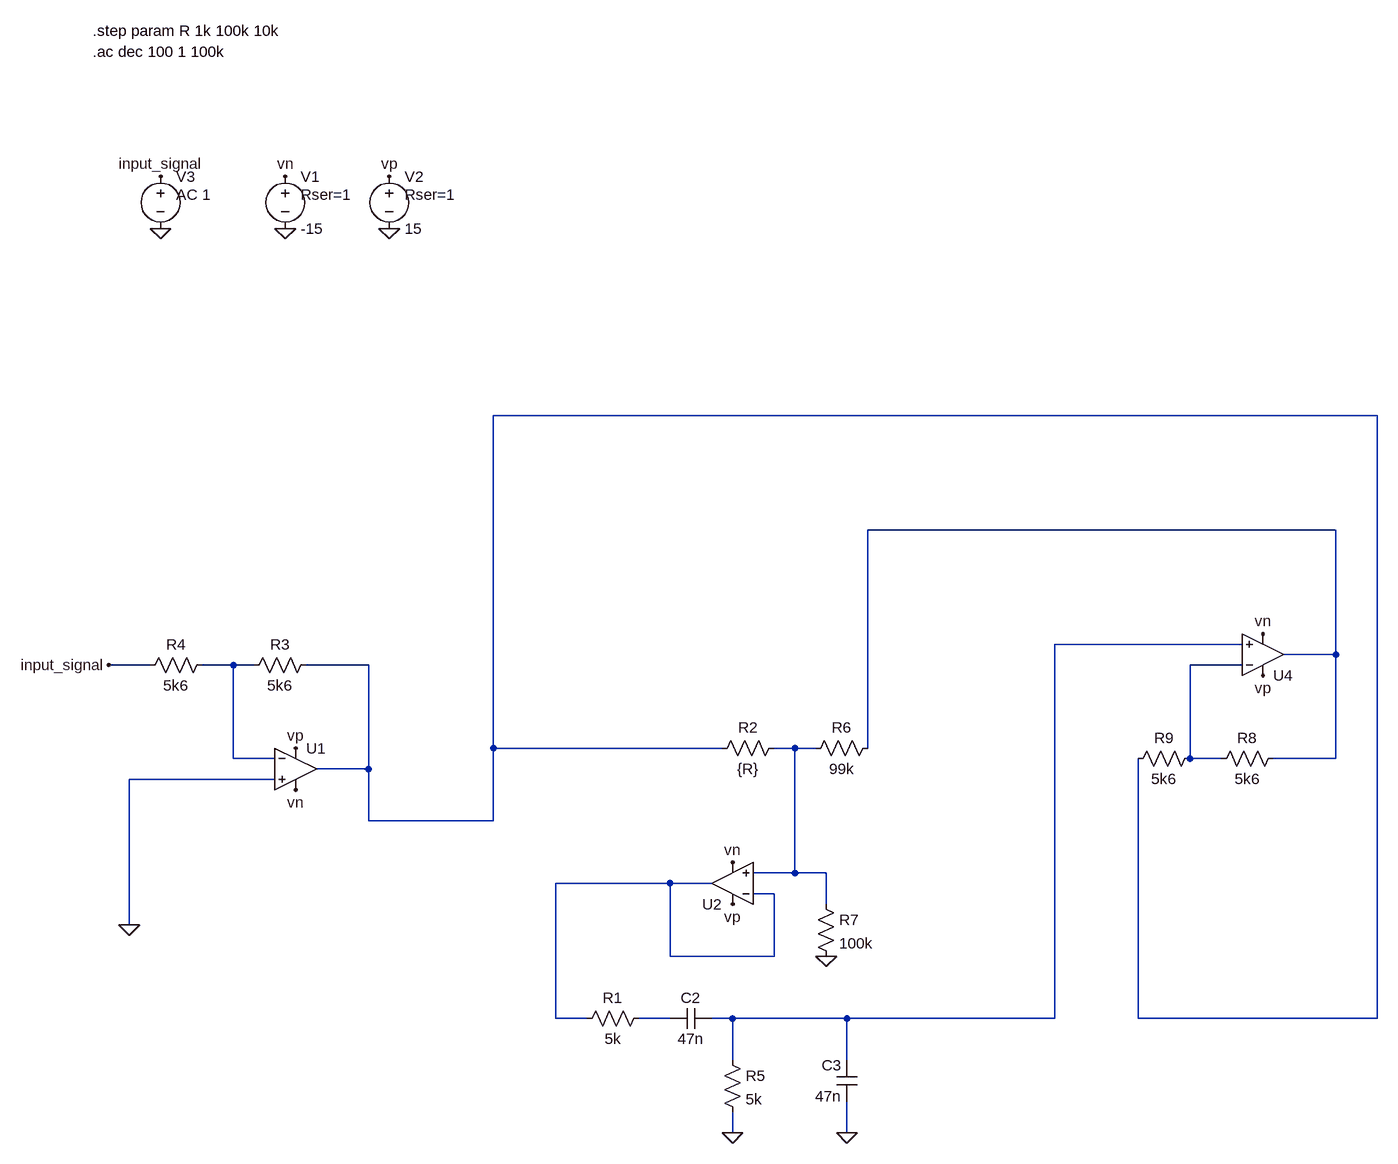
[diagram p0: schematic parametric_eq.asc]
parametric_eq.asc, the LTspice schematic file:
Version 4
SHEET 1 1476 820
WIRE 1360 -736 0 -736
WIRE 1296 -560 576 -560
WIRE 1152 -384 864 -384
WIRE 1296 -368 1296 -560
WIRE 1296 -368 1216 -368
WIRE -528 -352 -592 -352
WIRE -400 -352 -448 -352
WIRE -368 -352 -400 -352
WIRE -192 -352 -288 -352
WIRE 1152 -352 1072 -352
WIRE 0 -224 0 -736
WIRE 352 -224 0 -224
WIRE 464 -224 432 -224
WIRE 496 -224 464 -224
WIRE 576 -224 576 -560
WIRE -400 -208 -400 -352
WIRE -336 -208 -400 -208
WIRE 1072 -208 1072 -352
WIRE 1120 -208 1072 -208
WIRE 1296 -208 1296 -368
WIRE 1296 -208 1200 -208
WIRE -192 -192 -192 -352
WIRE -192 -192 -272 -192
WIRE -336 -176 -560 -176
WIRE -192 -112 -192 -192
WIRE 0 -112 0 -224
WIRE 0 -112 -192 -112
WIRE 464 -32 464 -224
WIRE 464 -32 400 -32
WIRE 512 -32 464 -32
WIRE 272 -16 96 -16
WIRE 336 -16 272 -16
WIRE 432 0 400 0
WIRE 512 16 512 -32
WIRE -560 48 -560 -176
WIRE 272 96 272 -16
WIRE 432 96 432 0
WIRE 432 96 272 96
WIRE 96 192 96 -16
WIRE 144 192 96 192
WIRE 272 192 224 192
WIRE 368 192 336 192
WIRE 544 192 368 192
WIRE 864 192 864 -384
WIRE 864 192 544 192
WIRE 992 192 992 -208
WIRE 1360 192 1360 -736
WIRE 1360 192 992 192
WIRE 368 256 368 192
WIRE 544 256 544 192
WIRE 368 368 368 336
WIRE 544 368 544 320
FLAG 368 368 0
FLAG -304 -224 vp
FLAG -160 -1104 vp
FLAG -304 -160 vn
FLAG -320 -1104 vn
FLAG -320 -1024 0
FLAG -160 -1024 0
FLAG -512 -1104 input_signal
FLAG -512 -1024 0
FLAG 544 368 0
FLAG -592 -352 input_signal
FLAG 368 16 vp
FLAG 368 -48 vn
FLAG 512 96 0
FLAG 1184 -336 vp
FLAG 1184 -400 vn
FLAG -560 48 0
SYMBOL res -272 -368 R90
WINDOW 0 0 56 VBottom 2
WINDOW 3 32 56 VTop 2
SYMATTR InstName R3
SYMATTR Value 5k6
SYMBOL res -544 -336 R270
WINDOW 0 32 56 VTop 2
WINDOW 3 0 56 VBottom 2
SYMATTR InstName R4
SYMATTR Value 5k6
SYMBOL OpAmps\\UniversalOpAmp -304 -192 R0
SYMATTR InstName U1
SYMBOL voltage -320 -1120 R0
WINDOW 123 0 0 Left 0
WINDOW 39 24 44 Left 2
SYMATTR SpiceLine Rser=1
SYMATTR InstName V1
SYMATTR Value -15
SYMBOL voltage -160 -1120 R0
WINDOW 123 0 0 Left 0
WINDOW 39 24 44 Left 2
SYMATTR SpiceLine Rser=1
SYMATTR InstName V2
SYMATTR Value 15
SYMBOL voltage -512 -1120 R0
WINDOW 123 24 44 Left 2
WINDOW 39 0 0 Left 0
SYMATTR Value2 AC 1
SYMATTR InstName V3
SYMATTR Value ""
SYMBOL res 240 176 R90
WINDOW 0 0 56 VBottom 2
WINDOW 3 32 56 VTop 2
SYMATTR InstName R1
SYMATTR Value 5k
SYMBOL res 352 240 R0
SYMATTR InstName R5
SYMATTR Value 5k
SYMBOL cap 336 176 R90
WINDOW 0 0 32 VBottom 2
WINDOW 3 32 32 VTop 2
SYMATTR InstName C2
SYMATTR Value 47n
SYMBOL cap 560 320 R180
WINDOW 0 24 56 Left 2
WINDOW 3 24 8 Left 2
SYMATTR InstName C3
SYMATTR Value 47n
SYMBOL OpAmps\\UniversalOpAmp 368 -16 R180
SYMATTR InstName U2
SYMBOL res 496 0 R0
SYMATTR InstName R7
SYMATTR Value 100k
SYMBOL res 448 -240 R90
WINDOW 0 0 56 VBottom 2
WINDOW 3 32 56 VTop 2
SYMATTR InstName R2
SYMATTR Value {R}
SYMBOL res 592 -240 R90
WINDOW 0 0 56 VBottom 2
WINDOW 3 32 56 VTop 2
SYMATTR InstName R6
SYMATTR Value 99k
SYMBOL res 1216 -224 R90
WINDOW 0 0 56 VBottom 2
WINDOW 3 32 56 VTop 2
SYMATTR InstName R8
SYMATTR Value 5k6
SYMBOL res 976 -192 R270
WINDOW 0 32 56 VTop 2
WINDOW 3 0 56 VBottom 2
SYMATTR InstName R9
SYMATTR Value 5k6
SYMBOL OpAmps\\UniversalOpAmp 1184 -368 M180
SYMATTR InstName U4
TEXT -616 -1296 Left 2 !.ac dec 100 1 100k
TEXT -616 -1328 Left 2 !.step param R 1k 100k 10k

The netlist it stands for:
* parametric_eq.asc
R3 N001 N004 5k6
R4 input_signal N004 5k6
XU1 0 N004 vp vn N001 level1 Avol=1Meg GBW=10Meg Vos=0 En=0 Enk=0 In=0 Ink=0 Rin=500Meg  ; pins In+ In- V+ V- OUT
V1 vn 0 -15 Rser=1
V2 vp 0 15 Rser=1
V3 input_signal 0 AC 1
R1 N008 N007 5k
R5 N003 0 5k
C2 N003 N008 47n
C3 0 N003 47n
XU2 N006 N007 vp vn N007 level1 Avol=1Meg GBW=10Meg Vos=0 En=0 Enk=0 In=0 Ink=0 Rin=500Meg  ; pins In+ In- V+ V- OUT
R7 N006 0 100k
R2 N006 N001 {R}
R6 N002 N006 99k
R8 N002 N005 5k6
R9 N001 N005 5k6
XU4 N003 N005 vp vn N002 level1 Avol=1Meg GBW=10Meg Vos=0 En=0 Enk=0 In=0 Ink=0 Rin=500Meg  ; pins In+ In- V+ V- OUT
.ac dec 100 1 100k
.step param R 1k 100k 10k
.lib UniversalOpAmp1.lib
.backanno
.end